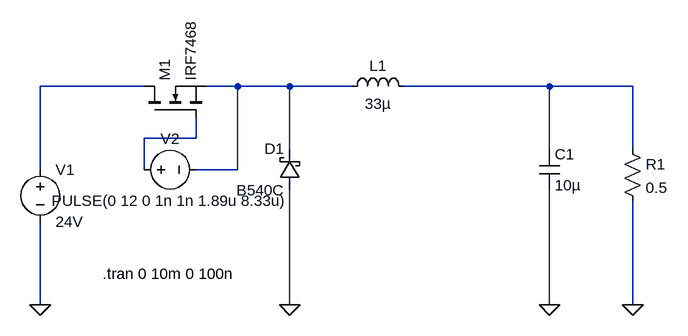
[diagram p0: schematic Buck_converter_24Vto5V.asc]
Buck_converter_24Vto5V.asc, the LTspice schematic file:
Version 4.1
SHEET 1 1036 680
WIRE 224 32 64 32
WIRE 368 32 320 32
WIRE 448 32 368 32
WIRE 544 32 448 32
WIRE 848 32 624 32
WIRE 976 32 848 32
WIRE 304 112 304 80
WIRE 304 112 224 112
WIRE 448 128 448 32
WIRE 848 128 848 32
WIRE 976 128 976 32
WIRE 64 160 64 32
WIRE 224 160 224 112
WIRE 368 160 368 32
WIRE 368 160 304 160
WIRE 64 368 64 240
WIRE 448 368 448 192
WIRE 848 368 848 192
WIRE 976 368 976 208
FLAG 64 368 0
FLAG 448 368 0
FLAG 848 368 0
FLAG 976 368 0
SYMBOL voltage 64 144 R0
WINDOW 123 0 0 Left 0
WINDOW 39 0 0 Left 0
SYMATTR InstName V1
SYMATTR Value 24V
SYMBOL nmos 224 80 R270
SYMATTR InstName M1
SYMATTR Value IRF7468
SYMBOL voltage 208 160 R270
WINDOW 0 32 56 VTop 2
WINDOW 3 -32 56 VBottom 2
WINDOW 123 0 0 Left 0
WINDOW 39 0 0 Left 0
SYMATTR InstName V2
SYMATTR Value PULSE(0 12 0 1n 1n 1.89u 8.33u)
SYMBOL schottky 464 192 R180
WINDOW 0 24 64 Left 2
WINDOW 3 24 0 Left 2
SYMATTR InstName D1
SYMATTR Value B540C
SYMATTR Description Diode
SYMATTR Type diode
SYMBOL ind 528 48 R270
WINDOW 0 32 56 VTop 2
WINDOW 3 5 56 VBottom 2
SYMATTR InstName L1
SYMATTR Value 33µ
SYMATTR SpiceLine Rser=1m
SYMBOL cap 832 128 R0
SYMATTR InstName C1
SYMATTR Value 10µ
SYMBOL res 960 112 R0
SYMATTR InstName R1
SYMATTR Value 0.5
TEXT 160 320 Left 2 !.tran 0 10m 0 100n

The netlist it stands for:
* Buck_converter_24Vto5V.asc
V1 N001 0 24V
M1 N001 N004 N002 N002 IRF7468
V2 N004 N002 PULSE(0 12 0 1n 1n 1.89u 8.33u)
D1 0 N002 B540C
L1 N002 N003 33µ Rser=1m
C1 N003 0 10µ
R1 N003 0 0.5
.model D D
.lib standard.dio
.model NMOS NMOS
.model PMOS PMOS
.lib standard.mos
.tran 0 10m 0 100n
.backanno
.end